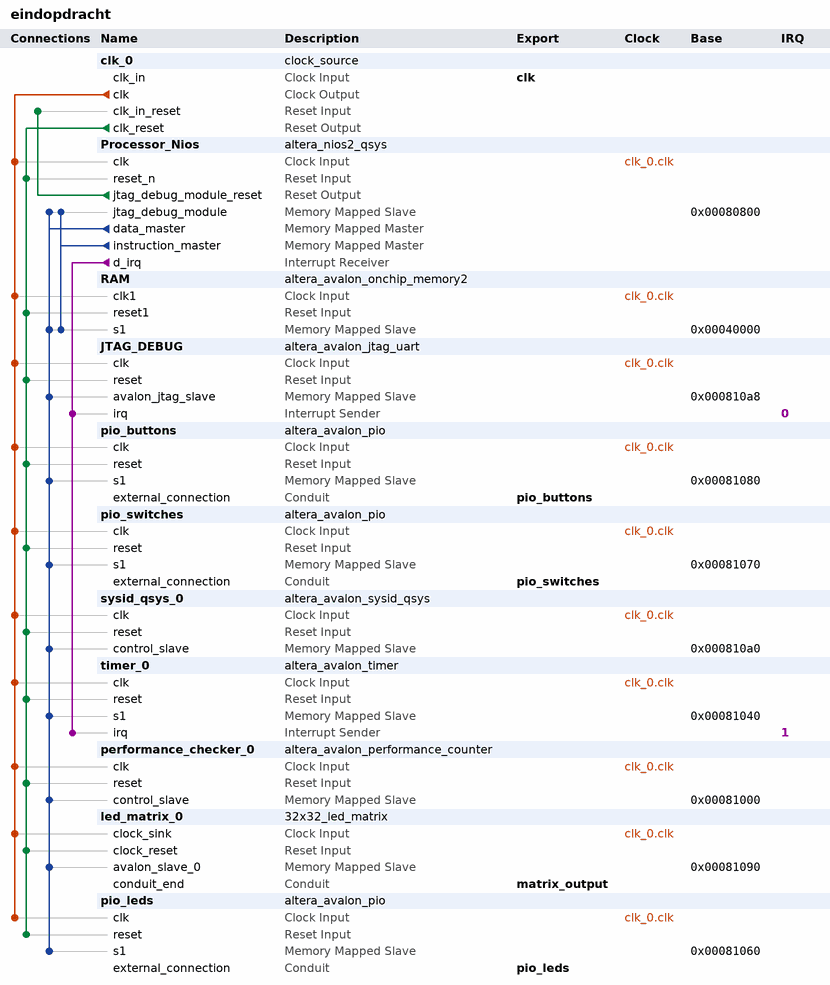
[diagram p0: system contents]
# Platform Designer (Qsys) system eindopdracht, Cyclone V 5CSEMA5F31C6
# Parameters at their usual value, and those the tool derives, are not listed.
package require -exact qsys 18.1
create_system eindopdracht
set_project_property DEVICE_FAMILY {Cyclone V}
set_project_property DEVICE 5CSEMA5F31C6

add_instance clk_0 clock_source 18.1
set_instance_parameter_value clk_0 clockFrequency 50000000

add_instance Processor_Nios altera_nios2_qsys 16.1
set_instance_parameter_value Processor_Nios breakSlave Processor_Nios.jtag_debug_module
set_instance_parameter_value Processor_Nios exceptionSlave RAM.s1
set_instance_parameter_value Processor_Nios icache_size 4096
set_instance_parameter_value Processor_Nios impl Tiny
set_instance_parameter_value Processor_Nios mmu_TLBMissExcSlave None
set_instance_parameter_value Processor_Nios resetSlave RAM.s1
set_instance_parameter_value Processor_Nios resetrequest_enabled true

add_instance RAM altera_avalon_onchip_memory2 18.1
set_instance_parameter_value RAM dataWidth 32
set_instance_parameter_value RAM dualPort false
set_instance_parameter_value RAM initMemContent true
set_instance_parameter_value RAM initializationFileName onchip_mem.hex
set_instance_parameter_value RAM memorySize 256000

add_instance JTAG_DEBUG altera_avalon_jtag_uart 18.1
set_instance_parameter_value JTAG_DEBUG simInteractiveOptions NO_INTERACTIVE_WINDOWS

add_instance pio_buttons altera_avalon_pio 18.1
set_instance_parameter_value pio_buttons captureEdge true
set_instance_parameter_value pio_buttons direction Input
set_instance_parameter_value pio_buttons generateIRQ true
set_instance_parameter_value pio_buttons irqType EDGE
set_instance_parameter_value pio_buttons width 4

add_instance pio_switches altera_avalon_pio 18.1
set_instance_parameter_value pio_switches direction Input
set_instance_parameter_value pio_switches generateIRQ true
set_instance_parameter_value pio_switches width 10

add_instance sysid_qsys_0 altera_avalon_sysid_qsys 18.1
set_instance_parameter_value sysid_qsys_0 id 0

add_instance timer_0 altera_avalon_timer 18.1
set_instance_parameter_value timer_0 period 1
set_instance_parameter_value timer_0 periodUnits MSEC

add_instance performance_checker_0 altera_avalon_performance_counter 18.1
set_instance_parameter_value performance_checker_0 numberOfSections 3

add_instance led_matrix_0 32x32_led_matrix 1.1

add_instance pio_leds altera_avalon_pio 18.1
set_instance_parameter_value pio_leds direction Output
set_instance_parameter_value pio_leds width 10

# connections
add_connection clk_0.clk JTAG_DEBUG.clk clock
add_connection clk_0.clk led_matrix_0.clock_sink clock
add_connection clk_0.clk performance_checker_0.clk clock
add_connection clk_0.clk pio_buttons.clk clock
add_connection clk_0.clk pio_leds.clk clock
add_connection clk_0.clk pio_switches.clk clock
add_connection clk_0.clk Processor_Nios.clk clock
add_connection clk_0.clk RAM.clk1 clock
add_connection clk_0.clk sysid_qsys_0.clk clock
add_connection clk_0.clk timer_0.clk clock
add_connection clk_0.clk_reset JTAG_DEBUG.reset reset
add_connection clk_0.clk_reset led_matrix_0.clock_reset reset
add_connection clk_0.clk_reset performance_checker_0.reset reset
add_connection clk_0.clk_reset pio_buttons.reset reset
add_connection clk_0.clk_reset pio_leds.reset reset
add_connection clk_0.clk_reset pio_switches.reset reset
add_connection clk_0.clk_reset Processor_Nios.reset_n reset
add_connection clk_0.clk_reset RAM.reset1 reset
add_connection clk_0.clk_reset sysid_qsys_0.reset reset
add_connection clk_0.clk_reset timer_0.reset reset
add_connection Processor_Nios.jtag_debug_module_reset clk_0.clk_in_reset reset
add_connection Processor_Nios.data_master JTAG_DEBUG.avalon_jtag_slave avalon
set_connection_parameter_value Processor_Nios.data_master/JTAG_DEBUG.avalon_jtag_slave baseAddress 0x000810a8
add_connection Processor_Nios.data_master led_matrix_0.avalon_slave_0 avalon
set_connection_parameter_value Processor_Nios.data_master/led_matrix_0.avalon_slave_0 baseAddress 0x00081090
add_connection Processor_Nios.data_master performance_checker_0.control_slave avalon
set_connection_parameter_value Processor_Nios.data_master/performance_checker_0.control_slave baseAddress 0x00081000
add_connection Processor_Nios.data_master pio_buttons.s1 avalon
set_connection_parameter_value Processor_Nios.data_master/pio_buttons.s1 baseAddress 0x00081080
add_connection Processor_Nios.data_master pio_leds.s1 avalon
set_connection_parameter_value Processor_Nios.data_master/pio_leds.s1 baseAddress 0x00081060
add_connection Processor_Nios.data_master pio_switches.s1 avalon
set_connection_parameter_value Processor_Nios.data_master/pio_switches.s1 baseAddress 0x00081070
add_connection Processor_Nios.data_master Processor_Nios.jtag_debug_module avalon
set_connection_parameter_value Processor_Nios.data_master/Processor_Nios.jtag_debug_module baseAddress 0x00080800
add_connection Processor_Nios.data_master RAM.s1 avalon
set_connection_parameter_value Processor_Nios.data_master/RAM.s1 baseAddress 0x00040000
add_connection Processor_Nios.data_master sysid_qsys_0.control_slave avalon
set_connection_parameter_value Processor_Nios.data_master/sysid_qsys_0.control_slave baseAddress 0x000810a0
add_connection Processor_Nios.data_master timer_0.s1 avalon
set_connection_parameter_value Processor_Nios.data_master/timer_0.s1 baseAddress 0x00081040
add_connection Processor_Nios.instruction_master Processor_Nios.jtag_debug_module avalon
set_connection_parameter_value Processor_Nios.instruction_master/Processor_Nios.jtag_debug_module baseAddress 0x00080800
add_connection Processor_Nios.instruction_master RAM.s1 avalon
set_connection_parameter_value Processor_Nios.instruction_master/RAM.s1 baseAddress 0x00040000
add_connection Processor_Nios.d_irq JTAG_DEBUG.irq interrupt
set_connection_parameter_value Processor_Nios.d_irq/JTAG_DEBUG.irq irqNumber 0
add_connection Processor_Nios.d_irq timer_0.irq interrupt
set_connection_parameter_value Processor_Nios.d_irq/timer_0.irq irqNumber 1

# exported interfaces
add_interface clk clock sink
set_interface_property clk EXPORT_OF clk_0.clk_in
add_interface matrix_output conduit end
set_interface_property matrix_output EXPORT_OF led_matrix_0.conduit_end
add_interface pio_buttons conduit end
set_interface_property pio_buttons EXPORT_OF pio_buttons.external_connection
add_interface pio_leds conduit end
set_interface_property pio_leds EXPORT_OF pio_leds.external_connection
add_interface pio_switches conduit end
set_interface_property pio_switches EXPORT_OF pio_switches.external_connection

set_interconnect_requirement {$system} qsys_mm.clockCrossingAdapter HANDSHAKE
set_interconnect_requirement {$system} qsys_mm.enableEccProtection FALSE
set_interconnect_requirement {$system} qsys_mm.insertDefaultSlave FALSE
set_interconnect_requirement {$system} qsys_mm.maxAdditionalLatency 1

save_system eindopdracht.qsys
